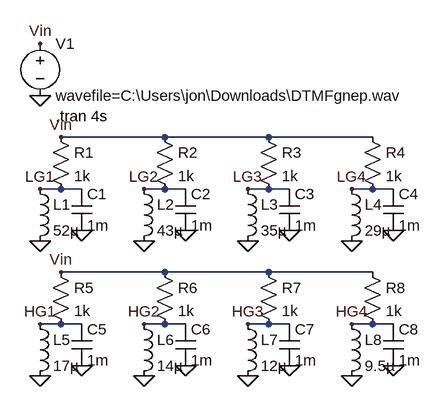
[diagram p0: schematic ece393_quiz1.asc]
ece393_quiz1.asc, the LTspice schematic file:
Version 4
SHEET 1 880 680
WIRE 240 192 80 192
WIRE 400 192 240 192
WIRE 560 192 400 192
WIRE 80 272 48 272
WIRE 112 272 80 272
WIRE 240 272 208 272
WIRE 272 272 240 272
WIRE 400 272 368 272
WIRE 432 272 400 272
WIRE 560 272 528 272
WIRE 592 272 560 272
WIRE 240 400 80 400
WIRE 400 400 240 400
WIRE 560 400 400 400
WIRE 80 480 48 480
WIRE 112 480 80 480
WIRE 240 480 208 480
WIRE 272 480 240 480
WIRE 400 480 368 480
WIRE 432 480 400 480
WIRE 560 480 528 480
WIRE 592 480 560 480
FLAG 48 272 LG1
FLAG 208 272 LG2
FLAG 368 272 LG3
FLAG 528 272 LG4
FLAG 48 352 0
FLAG 112 336 0
FLAG 208 352 0
FLAG 272 336 0
FLAG 368 352 0
FLAG 432 336 0
FLAG 528 352 0
FLAG 592 336 0
FLAG 48 560 0
FLAG 208 560 0
FLAG 368 560 0
FLAG 528 560 0
FLAG 592 544 0
FLAG 432 544 0
FLAG 272 544 0
FLAG 112 544 0
FLAG 48 128 0
FLAG 48 48 Vin
FLAG 80 192 Vin
FLAG 80 400 Vin
FLAG 48 480 HG1
FLAG 208 480 HG2
FLAG 368 480 HG3
FLAG 528 480 HG4
SYMBOL voltage 48 32 R0
SYMATTR InstName V1
SYMATTR Value wavefile=C:\Users\jon\Downloads\DTMFgnep.wav
SYMBOL ind 32 256 R0
SYMATTR InstName L1
SYMATTR Value 52µ
SYMBOL cap 96 272 R0
SYMATTR InstName C1
SYMATTR Value 1m
SYMBOL res 64 176 R0
SYMATTR InstName R1
SYMATTR Value 1k
SYMBOL res 224 176 R0
SYMATTR InstName R2
SYMATTR Value 1k
SYMBOL ind 192 256 R0
SYMATTR InstName L2
SYMATTR Value 43µ
SYMBOL cap 256 272 R0
SYMATTR InstName C2
SYMATTR Value 1m
SYMBOL ind 352 256 R0
SYMATTR InstName L3
SYMATTR Value 35µ
SYMBOL res 384 176 R0
SYMATTR InstName R3
SYMATTR Value 1k
SYMBOL cap 416 272 R0
SYMATTR InstName C3
SYMATTR Value 1m
SYMBOL ind 512 256 R0
SYMATTR InstName L4
SYMATTR Value 29µ
SYMBOL res 544 176 R0
SYMATTR InstName R4
SYMATTR Value 1k
SYMBOL cap 576 272 R0
SYMATTR InstName C4
SYMATTR Value 1m
SYMBOL res 64 384 R0
SYMATTR InstName R5
SYMATTR Value 1k
SYMBOL res 224 384 R0
SYMATTR InstName R6
SYMATTR Value 1k
SYMBOL res 384 384 R0
SYMATTR InstName R7
SYMATTR Value 1k
SYMBOL res 544 384 R0
SYMATTR InstName R8
SYMATTR Value 1k
SYMBOL ind 32 464 R0
SYMATTR InstName L5
SYMATTR Value 17µ
SYMBOL ind 192 464 R0
SYMATTR InstName L6
SYMATTR Value 14µ
SYMBOL ind 352 464 R0
SYMATTR InstName L7
SYMATTR Value 12µ
SYMBOL ind 512 464 R0
SYMATTR InstName L8
SYMATTR Value 9.5µ
SYMBOL cap 96 480 R0
SYMATTR InstName C5
SYMATTR Value 1m
SYMBOL cap 256 480 R0
SYMATTR InstName C6
SYMATTR Value 1m
SYMBOL cap 416 480 R0
SYMATTR InstName C7
SYMATTR Value 1m
SYMBOL cap 576 480 R0
SYMATTR InstName C8
SYMATTR Value 1m
TEXT 72 160 Left 2 !.tran 4s

The netlist it stands for:
* ece393_quiz1.asc
V1 Vin 0 wavefile=C:\Users\jon\Downloads\DTMFgnep.wav
L1 LG1 0 52µ
C1 LG1 0 1m
R1 Vin LG1 1k
R2 Vin LG2 1k
L2 LG2 0 43µ
C2 LG2 0 1m
L3 LG3 0 35µ
R3 Vin LG3 1k
C3 LG3 0 1m
L4 LG4 0 29µ
R4 Vin LG4 1k
C4 LG4 0 1m
R5 Vin HG1 1k
R6 Vin HG2 1k
R7 Vin HG3 1k
R8 Vin HG4 1k
L5 HG1 0 17µ
L6 HG2 0 14µ
L7 HG3 0 12µ
L8 HG4 0 9.5µ
C5 HG1 0 1m
C6 HG2 0 1m
C7 HG3 0 1m
C8 HG4 0 1m
.tran 4s
.backanno
.end